# EAGLE design ptvo_fs (EAGLE 9.6.2)
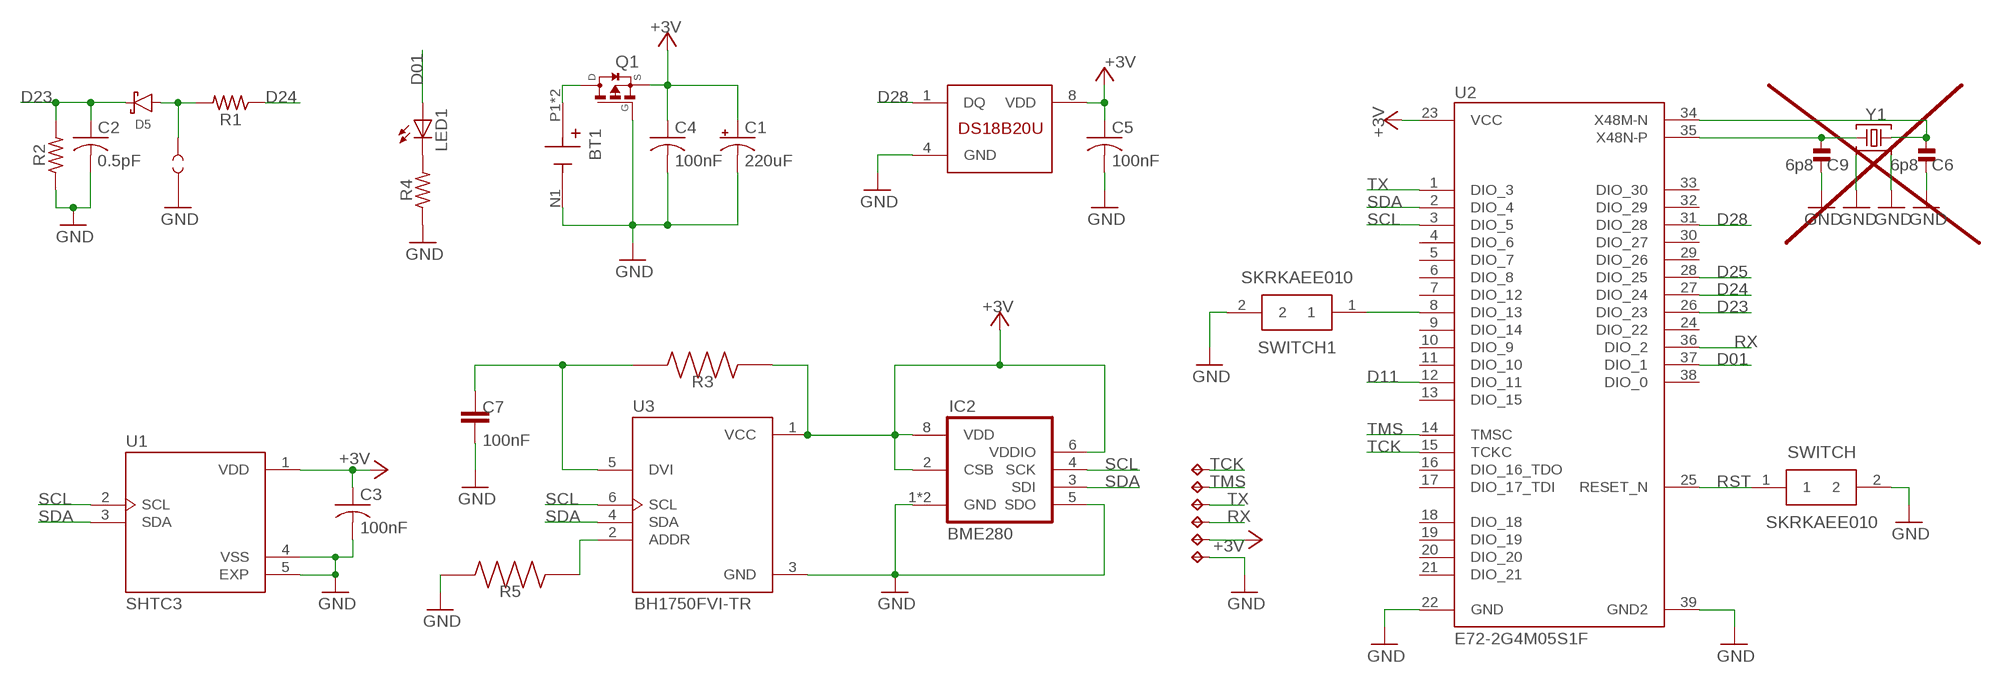
[diagram p0: schematic, sheet 1]

## Parts
BT1  BAT-HLD-001  [BAT_BAT-HLD-001]
C1  220uF  100UF-POLAR-EIA7343-10V-10%(TANT)  [EIA7343]
C2  0.5pF  C-USC0805  [C0805]
C3  100nF  C-USC0805  [C0805]
C4  100nF  C-USC0805  [C0805]
C5  100nF  C-USC0805  [C0805]
C6  6p8  CAP-0402  [_PKG_C_0402]
C7  100nF  CAP0402  [CAPC1005X40N]
C9  6p8  CAP-0402  [_PKG_C_0402]
D5  1N4148WS  DIODE-SCHOTTKY  [SOD-323]
IC1  DS18S20USOP8  [UMAX8]
IC2  BME280  [BME280]
LED1  LEDCHIP-LED0805  [CHIP-LED0805]
Q1  SI2323DS  [SOT23]
R1  10k  R-US_M0805  [M0805]
R2  1M  R-US_M0805  [M0805]
R3  4.7k  RC0402FR-073M6L  [RESC1005X40N]
R4  2.2k  R-US_M0805  [M0805]
R5  4.7k  RC0402FR-073M6L  [RESC1005X40N]
SWITCH  SKRKAEE010  [SKRK]
SWITCH1  SKRKAEE010  [SKRK]
TP1  TEST-POINT2  [PAD.02X.02]
TP2  TEST-POINT2  [PAD.02X.02]
TP3  TPB1,27  [B1,27]
TP4  TPB1,27  [B1,27]
TP5  TPB1,27  [B1,27]
TP6  TPB1,27  [B1,27]
TP7  TPB1,27  [B1,27]
TP8  TPB1,27  [B1,27]
U1  SHTC3  [SON100P200X200X80-5N]
U2  E72-2G4M05S1F  [E72-2G4M05S1F]
U3  BH1750FVI-TR  [XDCR_BH1750FVI-TR]
Y1  Q22FA12800150  48.000MHZ_CX2016DB48000C0FPLC1  [XTAL-4P-2016]

## Nets
+3V3: C1.A(+) C3.1 C4.1 C5.1 IC1.8(VDD) IC2.2(CSB) IC2.6(VDDIO) IC2.8(VDD) Q1.2(S) R3.1 TP6.TP U1.1(VDD) U2.23(VCC) U3.1(VCC) ; supply symbol labelled +3V
D01: LED1.A U2.37(DIO_1)
D11: U2.12(DIO_11)
D23: C2.1 D5.C R2.2 U2.26(DIO_23)
D24: R1.1 U2.27(DIO_24)
D25: U2.28(DIO_25)
D28: IC1.1(DQ) U2.31(DIO_28)
GND: BT1.N1(-) C1.C(-) C2.2 C3.2 C4.2 C5.2 C6.1 C7.2 C9.1 IC1.4(GND) IC2.1(GND) IC2.5(SDO) IC2.7(GND) Q1.1(G) R2.1 R4.1 R5.2 SWITCH1.2 SWITCH.2 TP2.P$1 TP7.TP U1.4(VSS) U1.5(EXP) U2.22(GND) U2.39(GND2) U3.3(GND) Y1.2 Y1.4
N$1: D5.A R1.2 TP1.P$1
N$2: LED1.C R4.2
N$3: SWITCH1.1 U2.8(DIO_13)
N$4: BT1.P1(+) BT1.P2(+) Q1.3(D)
N$5: C6.2 U2.34(X48M-N) Y1.3
N$6: C7.1 R3.2 U3.5(DVI)
N$9: R5.1 U3.2(ADDR)
N$21: C9.2 U2.35(X48N-P) Y1.1
RST: SWITCH.1 U2.25(RESET_N)
RX: TP5.TP U2.36(DIO_2)
SCL: IC2.4(SCK) U1.2(SCL) U2.3(DIO_5) U3.6(SCL)
SDA: IC2.3(SDI) U1.3(SDA) U2.2(DIO_4) U3.4(SDA)
TCK: TP8.TP U2.15(TCKC)
TMS: TP3.TP U2.14(TMSC)
TX: TP4.TP U2.1(DIO_3)
Unconnected: U2.4(DIO_6) U2.5(DIO_7) U2.6(DIO_8) U2.7(DIO_12) U2.9(DIO_14) U2.10(DIO_9) U2.11(DIO_10) U2.13(DIO_15) U2.16(DIO_16_TDO) U2.17(DIO_17_TDI) U2.18(DIO_18) U2.19(DIO_19) U2.20(DIO_20) U2.21(DIO_21) U2.24(DIO_22) U2.29(DIO_26) U2.30(DIO_27) U2.32(DIO_29) U2.33(DIO_30) U2.38(DIO_0)

## Library data of the parts
BT1 = BAT-HLD-2450:BAT-HLD-001
C1 = SparkFun-Capacitors:100UF-POLAR: 100µF polarized capacitors A capacitor is a passive two-terminal electrical component used to store electrical energy temporarily in an electric field.; PROD_ID: CAP-07890; VALUE: 100uF
C2-C5 = adafruit2:C-US: CAPACITOR, American symbol
C6 C9 = ok-discretes-dev:CAP
C7 = discretes-dev:CAP0402: CAP, 0402; AVAILABILITY: Good; DESCRIPTION: RESISTOR, 0402 0.063W 1% 3M6; Resistance:3.6Mohm; Resistance Tolerance:± 1%; Power Rating:0.063W; Voltage Rating:50V; Series:RC32H; Temperature Coefficient:± 100ppm/°C; Resistor Element Type:Thick Film; Resistor Case Style:0402; No. of Pins:2; SVHC:No SVHC; Case Style:0402; External Length / Height:1mm; Temperature Coeff. +:100ppm/°C; Temperature Coeff. -:100ppm/°C; External Depth:0.35mm; External Width:0.5mm; Operating Temperature Range:-55°C to +155°C; Overload Voltage:100V; MF: Yageo; MP: RC0402FR-073M6L; PACKAGE: 1005 Panasonic Electronic Components; PRICE: None; PURCHASE-URL: https://pricing.snapeda.com/search/part/RC0402FR-073M6L/?ref=eda
D5 = pimoroni-passives:DIODE-SCHOTTKY
IC1 = 1wire:DS18S20: High Precision Digital Thermometer This chip provides a onewire thermosensor with approx. 0.5°C accuracy.A programmable over/undertemperure alarm is available. Notes: Vdd must be applied for accurate measurements at low temperatures, as the parasite power circuit otherwise heats the sensor. If parasite power is used, Vdd has to be connected to GND. The DS1822 is a low-cost thermometer chip, the DS18B20 is similar to the DS18S20, but with 9..12 Bit programmable precision. Author: Jan Kandziora <jjj@gmx.de>
IC2 = bosch-bme280:BME280: DIGITAL HUMIDITY, PRESSURE AND TEMPERATURE SENSOR * Digital interface I²C (up to 3.4 MHz) and SPI (3 and 4 wire, up to 10 MHz)* Supply voltage VDD main supply voltage range: 1.71 V to 3.6 V*VDDIO interface voltage range: 1.2 V to 3.6 V Operating range -40…+85 °C, 0…100 % rel. humidity, 300…1100 hPa The library has been designed by Richard Magdycz <https://www.facebook.com/groups/eaglecadsoftUK>
LED1 = adafruit:LED: LED OSRAM: - CHIPLED LG R971, LG N971, LY N971, LG Q971, LY Q971, LO R971, LY R971 LH N974, LH R974 LS Q976, LO Q976, LY Q976 LO Q996 - Hyper CHIPLED LW Q18S LB Q993, LB Q99A, LB R99A - SideLED LS A670, LO A670, LY A670, LG A670, LP A670 LB A673, LV A673, LT A673, LW A673 LH A674 LY A675 LS A676, LA A676, LO A676, LY A676, LW A676 LS A679, LY A679, LG A679 - Hyper Micro SIDELED® LS Y876, LA Y876, LO Y876, LY Y876 LT Y87S - SmartLED LW L88C, LW L88S LB L89C, LB L89S, LG L890 LS L89K, LO L89K, LY L89K LS L896, LA L896, LO L896, LY L896 - TOPLED LS T670, LO T670, LY T670, LG T670, LP T670 LSG T670, LSP T670, LSY T670, LOP T670, LYG T670 LG T671, LOG T671, LSG T671 LB T673, LV T673, LT T673, LW T673 LH T674 LS T676, LA T676, LO T676, LY T676, LB T676, LH T676, LSB T676, LW T676 LB T67C, LV T67C, LT T67C, LS T67K, LO T67K, LY T67K, LW E67C LS E67B, LA E67B, LO E67B, LY E67B, LB E67C, LV E67C, LT E67C LW T67C LS T679, LY T679, LG T679 LS T770, LO T770, LY T770, LG T770, LP T770 LB T773, LV T773, LT T773, LW T773 LH T774 LS E675, LA E675, LY E675, LS T675 LS T776, LA T776, LO T776, LY T776, LB T776 LHGB T686 LT T68C, LB T68C - Hyper Mini TOPLED® LB M676 - Mini TOPLED Santana® LG M470 LS M47K, LO M47K, LY M47K Source: http://www.osram.convergy.de/
Q1 = SI2323DS:SI2323DS: P-Channel MOSFET; AVAILABILITY: Unavailable; DESCRIPTION: P-Channel 20V 3.7A (Ta) 750mW (Ta) Surface Mount SOT-23-3 (TO-236); MF: Vishay Siliconix; MP: SI2323DS; PACKAGE: SOT-23-3 Vishay Siliconix; PRICE: None
R1 R2 R4 = adafruit4:R-US_: RESISTOR, American symbol
R3 R5 = RC0402FR-073M6L:RC0402FR-073M6L: RESISTOR, 0402 0.063W 1% 3M6; Resistance:3.6Mohm; Resistance Tolerance:± 1%; Power Rating:0.063W; Voltage Rating:50V; Series:RC32H; Temperature Coefficient:± 100ppm/°C; Resistor Element Type:Thick Film; Resistor Case Style:0402; No. of Pins:2; SVHC:No SVHC; Case Style:0402; External Length / Height:1mm; Temperature Coeff. +:100ppm/°C; Temperature Coeff. -:100ppm/°C; External Depth:0.35mm; External Width:0.5mm; Operating Temperature Range:-55°C to +155°C; Overload Voltage:100V Check prices <https://pricing.snapeda.com/parts/RC0402FR-073M6L/Yageo/view-part?ref=eda>; AVAILABILITY: Good; DESCRIPTION: RESISTOR, 0402 0.063W 1% 3M6; Resistance:3.6Mohm; Resistance Tolerance:± 1%; Power Rating:0.063W; Voltage Rating:50V; Series:RC32H; Temperature Coefficient:± 100ppm/°C; Resistor Element Type:Thick Film; Resistor Case Style:0402; No. of Pins:2; SVHC:No SVHC; Case Style:0402; External Length / Height:1mm; Temperature Coeff. +:100ppm/°C; Temperature Coeff. -:100ppm/°C; External Depth:0.35mm; External Width:0.5mm; Operating Temperature Range:-55°C to +155°C; Overload Voltage:100V; MF: Yageo; MP: RC0402FR-073M6L; PACKAGE: 1005 Panasonic Electronic Components; PRICE: None; PURCHASE-URL: https://pricing.snapeda.com/search/part/RC0402FR-073M6L/?ref=eda
SWITCH SWITCH1 = SPST Round Button:SKRKAEE010: Tactile Switches 3.9x2.9x2.0mm 160gf Packaging Temp 60oC <https://componentsearchengine.com/Images/1/SKRKAEE010.jpg> Source: Datasheet <http://www.mouser.com/ds/2/15/SKRK-1110686.pdf> Check availability <https://pricing.snapeda.com/parts/SKRKAEE010/ALPS/view-part?ref=eda>; AVAILABILITY: Not in stock; CHECK_PRICES: https://www.snapeda.com/parts/SKRKAEE010/ALPS/view-part/?ref=eda; DESCRIPTION: Switch Tactile N.O. SPST Round Button Gull Wing 0.05A 12VDC 1.57N SMD T/R; MF: ALPS; MP: SKRKAEE010; PACKAGE: None; PRICE: None; SNAPEDA_LINK: https://www.snapeda.com/parts/SKRKAEE010/ALPS/view-part/?ref=snap
TP1 TP2 = SparkFun-Connectors:TEST-POINT: SparkFun Test Points Bare copper test points for troubleshooting or In-Circuit-Testing. These are used by our Production team for verifying production board runs using pogo-pins on test beds. SparkFun Products: SparkFun LSM9DS1 Breakout <https://www.sparkfun.com/products/13284> SparkFun PSOC <https://www.sparkfun.com/products/13714> SparkFun Load Cell Amplifier <https://www.sparkfun.com/products/13879>
TP3-TP8 = testpad:TP: Test pad
U1 = SHTC3:SHTC3: SENSOR HUMI/TEMP I2C 2% SMD Check availability <https://pricing.snapeda.com/parts/SHTC3/Sensirion%20AG/view-part?ref=eda>; AVAILABILITY: In Stock; DESCRIPTION: SENSOR HUMI/TEMP I2C 2% SMD; MF: Sensirion AG; MP: SHTC3; PACKAGE: DFN-4 Sensirion; PRICE: None; PURCHASE-URL: https://pricing.snapeda.com/search/part/SHTC3/?ref=eda
U2 = E72-2G4M05S1F:E72-2G4M05S1F
U3 = BH1750FVI-TR:BH1750FVI-TR: Light to Digital Ambient Light Sensor Digital O/P 1lux to 65535lux 6-Pin WSOF Embossed T/R Check availability <https://pricing.snapeda.com/parts/BH1750FVI-TR/Rohm/view-part?ref=eda>; AVAILABILITY: In Stock; CHECK_PRICES: https://www.snapeda.com/parts/BH1750FVI-TR/Rohm/view-part/?ref=eda; DESCRIPTION: Optical Sensor Ambient 560nm I2C 6-SMD, Flat Lead Exposed Pad; MF: Rohm; MP: BH1750FVI-TR; PACKAGE: SMD-6 ROHM Semiconductor; PRICE: None; PURCHASE-URL: https://www.snapeda.com/api/url_track_click_mouser/?unipart_id=106507&manufacturer=Rohm&part_name=BH1750FVI-TR&search_term=bh1750fvi-tr; SNAPEDA_LINK: https://www.snapeda.com/parts/BH1750FVI-TR/Rohm/view-part/?ref=snap
Y1 = ok-xtal-osc-dev:48.000MHZ_CX2016DB48000C0FPLC1: 48MHz ±10ppm Crystal 7pF 50 Ohms 4-SMD, No Lead Datasheet <https://media.digikey.com/pdf/Data%20Sheets/Kyocera%20International/CX2016DB48000C0FPLC1_DS.pdf>; DIGIKEY_PART: 1253-2042-1-ND; MFG_NAME: KYOCERA; MFG_PART: CX2016DB48000C0FPLC1

## Board
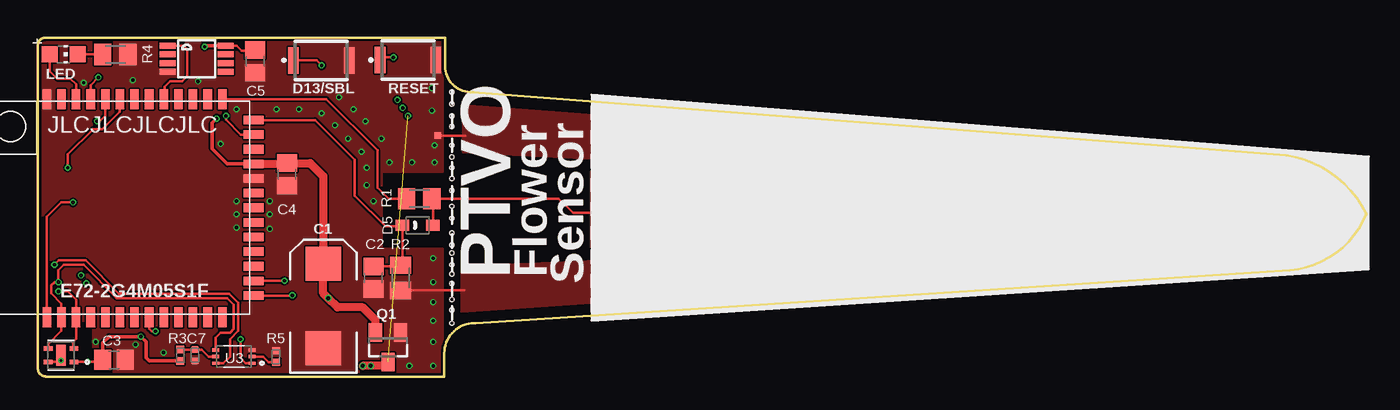
[diagram p1: board, top side]
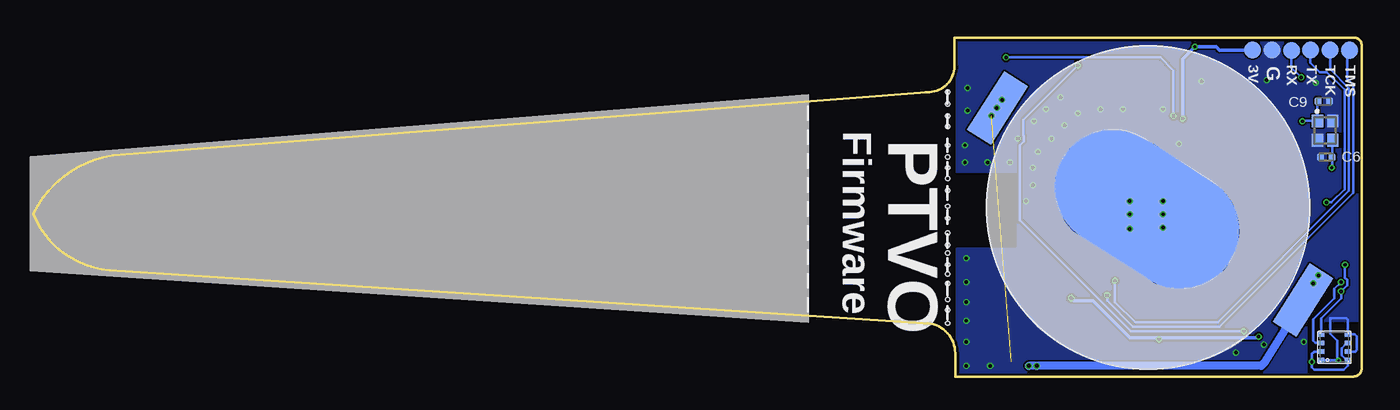
[diagram p2: board, bottom side, seen from below]

Size 99.95 x 25.48 mm. Coordinates in mm from the lower left corner, seen from the top.
Outline: 32.82,21.38 32.7,21.38
Outline: 32.7,21.38 arc-90 30.62,23.35 30.62,25.48 0.53,25.48 arc90 0,24.95 0,0.6 arc90 0.6,0 30.57,0 30.57,1.75 arc-90 32.82,4 32.95,4 94.2,8 arc64 99.95,12.25 arc55 93.95,16.62 32.7,21.38
Copper layers (1*16): Top 0.035559375mm / dielectric 0.17018125mm / Bottom 0.035559375mm
Design rules "oshpark-4layer *": minimum track width 6mil, minimum drill 0.2mm, track to track 5mil, track to pad 5mil, pad to pad 5mil, via to via 5mil, smd to smd 5mil, copper to edge 0.16mm, drill to drill 0.2mm, minimum pad ring 4mil, minimum via ring 4mil, stop-mask expansion 0.05588125mm, vias tented up to drill 50mil, thermal gap 10mil
Holes 0.3 mm at 31.15,4 31.15,5 31.15,5.8 31.15,7 31.15,7.7 31.15,8.4 31.15,9.3 31.15,9.9 31.15,10.8 31.15,11.9 31.15,12.8 31.15,14 31.15,14.9 31.15,15.7 31.15,16.5 31.15,17.4 31.15,18.8 31.15,19.6 31.15,20.5 31.15,21.4

### Footprints (pad centres in the part's own frame; a part is rotated, then mirrored left to right if it is on the bottom)
BAT_BAT-HLD-001 = smd 14.8 x 8.8: N1 -0.127,-0.254 | smd 2.1 x 5.2: P1 -13.704,0.127; P2 13.45,0.254
EIA7343 = smd 2.55 x 2.7: A 3.17,0; C -3.17,0
C0805 = smd 1.3 x 1.5: 1 -0.85,0; 2 0.85,0
_PKG_C_0402 = smd 0.54 x 0.6: 1 -0.43,0; 2 0.43,0
CAPC1005X40N = smd 0.54 x 0.6: 1 -0.432,0; 2 0.432,0
SOD-323 = smd 1 x 0.8: A 1.15,0; C -1.15,0
UMAX8 = smd 0.45 x 1.2: 1 -0.975,-2.175; 2 -0.325,-2.175; 3 0.325,-2.175; 4 0.975,-2.175; 5 0.975,2.175; 6 0.325,2.175; 7 -0.325,2.175; 8 -0.975,2.175
BME280 = smd 0.35 x 0.5: 1 0.975,-1.025; 2 0.325,-1.025; 3 -0.325,-1.025; 4 -0.975,-1.025; 5 -0.975,1.025; 6 -0.325,1.025; 7 0.325,1.025; 8 0.975,1.025
CHIP-LED0805 = smd 1.2 x 1.2: A 0,-1.05; C 0,1.05
SOT23 = smd 1 x 1.4: 1 -0.95,-1.1; 2 0.95,-1.1; 3 0,1.1
M0805 = smd 1.3 x 1.6: 1 -0.95,0; 2 0.95,0
RESC1005X40N = smd 0.54 x 0.6: 1 -0.432,0; 2 0.432,0
SKRK = smd 0.8 x 2: 1 -2.1,0; 2 2.1,0
PAD.02X.02 = smd 0.508 x 0.508: P$1 0,0
B1,27 = smd 1.27 x 1.27: TP 0,0
SON100P200X200X80-5N = smd 0.75 x 0.35: 1 -0.97,0.5; 2 -0.97,-0.5; 3 0.97,-0.5; 4 0.97,0.5 | smd 0.7 x 1.6: 5 0,0
E72-2G4M05S1F = smd 1.5 x 0.65: 1 -8.43,3.15; 2 -8.43,2.05; 3 -8.43,0.95; 4 -8.43,-0.15; 5 -8.43,-1.25; 6 -8.43,-2.35; 7 -8.43,-3.45; 8 -8.43,-4.55; 9 -8.43,-5.65; 10 -8.43,-6.75; 11 -8.43,-7.85; 12 -8.43,-8.95; 13 -8.43,-10.05; 27 7.96,-10.05; 28 7.96,-8.95; 29 7.96,-7.85; 30 7.96,-6.75; 31 7.96,-5.65; 32 7.96,-4.55; 33 7.96,-3.45; 34 7.96,-2.35; 35 7.96,-1.25; 36 7.96,-0.15; 37 7.96,0.95; 38 7.96,2.05; 39 7.96,3.15 | smd 0.65 x 1.5: 14 -6.81,-12.4; 15 -5.71,-12.4; 16 -4.61,-12.4; 17 -3.51,-12.4; 18 -2.41,-12.4; 19 -1.31,-12.4; 20 -0.21,-12.4; 21 0.89,-12.4; 22 1.99,-12.4; 23 3.09,-12.4; 24 4.19,-12.4; 25 5.29,-12.4; 26 6.39,-12.4
XDCR_BH1750FVI-TR = smd 0.55 x 0.25: 1 -1.375,0.5; 2 -1.375,0; 3 -1.375,-0.5; 4 1.375,-0.5; 5 1.375,0; 6 1.375,0.5
XTAL-4P-2016 = smd 0.95 x 0.85: 1 -0.725,-0.575; 2 0.725,-0.575; 3 0.725,0.575; 4 -0.725,0.575

### Placement (x,y rotation side)
BT1  15.9,12.75 327.6 bottom
C1  21.48,5.3 90 top
C2  25.25,7.42 270 top
C3  5.73,1.25 0 top
C4  18.75,15.2 270 top
C5  16.35,23.7 270 top
C6  2.65,16.5 0 bottom
C7  11.82,1.6 270 top
C9  2.85,20.7 180 bottom
D5  28.57,11.38 0 top
IC1  11.95,23.9 270 top
IC2  2.05,2.2 270 bottom
LED1  1.95,24.23 270 top
Q1  26.35,2.2 180 top
R1  28.7,13.38 0 top
R2  27.3,7.42 90 top
R3  10.72,1.6 90 top
R4  5.83,24.23 180 top
R5  17.92,1.5 90 top
SWITCH  27.85,23.8 0 top
SWITCH1  21.32,23.78 0 top
TP1  29.82,13.38 0 top
TP2  30.1,18.12 0 top
TP3  0.92,24.54 90 bottom
TP4  3.85,24.55 90 bottom
TP5  5.29,24.53 90 bottom
TP6  8.21,24.55 90 bottom
TP7  6.75,24.55 90 bottom
TP8  2.36,24.55 90 bottom
U1  1.75,1.6 180 top
U2  3.82,12.9 90 top
U3  14.75,1.5 180 top
Y1  2.75,18.5 270 bottom

### Tracks (layer width: path | path; a pad name or v marks a point on that pad's centre or on a via)
+3V3  (via drill 0.25, 0.3)
  Top 0.2: U3.1 15.65,1 15.25,1.4 v15.25,2.8
  Top 0.203: U1.1 v3.75,1.1 4.73,1.1 C3.1 | IC1.8 14.97,24.88 15.35,24.5 16.3,24.5 C5.1
  Top 0.254: U2.23 14.26,15.99 13.13,17.12 13.13,19.08 v13.45,19.4 | v12.55,24.8 12.62,24.88 IC1.8 | C3.1 4.88,2.52 5.35,3 v7.75,3 8.15,2.6 8.15,1.4 8.38,1.17 R3.1
  Top 0.61: U2.23 18.69,15.99 C4.1 20.5,16.05 21.48,15.07 C1.A 21.48,6.27 v21.85,5.9 22.55,5.2 24.45,5.2 25.4,4.25 Q1.2
  Bottom 0.2: IC2.6 1.12,2.52 1.5,2.14 1.5,1.61 1.12,1.23 IC2.8 1.02,0.83 1.35,0.5 3.55,0.5 3.75,0.7 v3.75,1.1 3.75,1.7 3.57,1.88 IC2.2
  Bottom 0.254: v13.45,19.4 13.45,23.9 v12.55,24.8 10.95,24.8 10.7,24.55 TP6.TP | v7.75,3 7.85,2.9 15.15,2.9 v15.25,2.8 15.35,2.9 17.43,2.9 20.23,5.7 21.65,5.7 v21.85,5.9
D01
  Top 0.203: LED1.A 0.9,22.95 1.45,22.4 2.45,22.4 2.88,21.98 U2.37
D23
  Top 0.203: D5.C 27.42,11.3 | 27.42,11.3 27.42,8.5 R2.2 27.2,8.28 C2.1 | U2.26 20.86,19.29 23.85,16.3 23.85,13.6 26.15,11.3 27.42,11.3
D24
  Top 0.203: R1.1 26.38,13.38 25.55,14.2 25.55,17 21.69,20.86 U2.27
D28
  Top 0.203: IC1.1 10.97,24.88 11.25,24.6 11.25,22.6 10.85,22.2 9.95,22.2 9.55,21.8 9.55,20.94 U2.31
GND  (via drill 0.2, 0.25)
  Top 0.2: U1.5 1.75,1.1
  Top 0.203: R2.1 32.05,6.47 | TP2.P$1 32.12,18.12 32.15,18.1 | U1.4 1.55,1.1 1.65,1 1.75,1.1 v1.75,1.2
  Bottom 0.2: IC2.7 0.48,1.88 0.36,2 0.36,3.01 0.53,3.18 IC2.5 1.02,4.27 1.15,4.4 2.35,4.4 2.35,3.2 1.85,2.7 1.85,1.3 v1.75,1.2 1.77,1.23 IC2.1
  Bottom 0.203: BT1.N1 14.95,11.41 v14.95,11.2 | BT1.N1 15.55,12.6 v14.95,13.2 | BT1.N1 17.05,12.6 v17.45,12.2 | BT1.N1 17.45,11.29 v17.45,11.1 | BT1.N1 15.74,12.2 v14.95,12.2
  other vias: 24.75,14.4 24.75,15.7 24.35,16.9 23.35,17.9 22.35,18.9 21.35,19.8 19.65,20.1 17.95,20.1 25.25,13.2 14.95,20.1 12.05,22.2 29.65,20 29.65,21.7 29.75,8.9 29.75,7.1 22.65,21 23.75,20.1 24.65,19.2 25.85,17.9 26.45,16.1 28.15,16.1 29.85,16.1 13.75,17.5 17.45,13.2 29.75,5.6 29.75,4.2 29.75,2.6 29.75,0.8 27.95,0.8 29.85,17.4 4.35,2.6 7.15,22.3 3.45,22.1 7.35,2.4 9.45,1.8
  pour Top: 31.95,16.88 94.58,13.75 arc-169 94.7,11 31.82,8.25 31.82,4.89 94.37,9.21 arc160 95.06,15.58 31.95,20.41
  pour Top (no thermals): 29.75,18.4 29.75,17.8 30.35,17.8 30.35,18.4
  pour Bottom (no thermals): -0.25,4.2 4.15,4.2 4.15,-0.4 30.45,-0.4 30.45,9.6 25.85,9.6 25.85,15.4 30.45,15.4 30.45,26 -0.25,26
  pour Top (no thermals): -0.15,4.2 4.15,4.2 4.15,-0.8 30.45,-0.8 30.45,9.6 25.85,9.6 25.85,15.4 30.45,15.4 30.45,25.6 -0.15,25.6
N$1
  Top 0.2: 29.9,11.55 D5.A 29.72,13.3 | R1.2 39.17,13.38 40.25,12.3 42.05,12.3
  Top 0.254: 29.72,13.3 R1.2 TP1.P$1
  pour Top: 41.6,15.45 41.6,9.72 94.34,11.64 arc168 94.45,13.08
N$2
  Top 0.203: LED1.C R4.2
N$3  (via drill 0.25)
  Top 0.2: U2.8 8.38,3.58 8.55,3.4 v8.85,3.4 | SWITCH1.1 20.97,23.78 v21.35,23.4
  Bottom 0.2: v8.85,3.4 17.35,3.4 25.7,11.75 25.7,17.41 25.4,17.71 25.4,18.09 25.45,18.14 25.45,19.3 v21.35,23.4
N$4  (via drill 0.25, 0.3)  (1 unrouted)
  Top 0.61: Q1.3 26.05,0.8 v24.45,0.8
  Bottom 0.203: BT1.P1 v27.45,20.2 | BT1.P1 27.85,19.75 v27.85,19.6 | BT1.P1 27.05,20.55 v27.05,20.8
  Bottom 0.254: v3.65,7 3.65,6.51 BT1.P2 3.25,6.91 v3.25,7.6
  Bottom 0.61: BT1.P2 7.35,1 7.55,0.8 v24.45,0.8 v25.05,0.8
N$5  (via drill 0.25)
  Top 0.2: U2.34 6.18,19.93 4.85,18.6 4.15,18.6 2.25,16.7 v2.25,15.7
  Bottom 0.2: Y1.3 2.22,17.73 C6.2 2.22,15.73 v2.25,15.7
N$6
  Top 0.2: R3.2 C7.1 12.32,2.03 12.85,1.5 U3.5
N$9
  Top 0.2: R5.1 17.38,1.07 16.95,1.5 U3.2
N$21  (via drill 0.25)
  Top 0.2: U2.35 5.08,19.62 4.65,19.2 v4.45,19.2
  Bottom 0.2: C9.2 3.32,20.66 Y1.1 4.43,19.23 v4.45,19.2
RST  (via drill 0.25)
  Top 0.203: U2.25 15.26,18.19 14.15,19.3 v14.15,19.6 | v26.75,24 25.95,24 SWITCH.1
  Bottom 0.203: v14.15,19.6 14.15,23 15.15,24 v26.75,24
RX  (via drill 0.25)
  Top 0.203: U2.36 3.98,21.93 v4.55,22.5
  Bottom 0.203: TP5.TP 5.29,23.24 v4.55,22.5
SCL  (via drill 0.25)
  Top 0.2: U1.2 2.65,2.17 2.65,2.6 2.88,2.83 U2.3 2.88,5.77 2.25,6.4 v1.55,6.4 | U3.6 13.95,1 14.45,1.5 14.45,2.8 15.08,3.43 15.08,5.53 14.38,6.23 6.08,6.23 3.58,8.73 1.58,8.73 v1.25,8.4
  Bottom 0.2: IC2.4 3.05,3.2 3.05,4.4 1.55,5.9 v1.55,6.4 1.1,6.85 1.1,7.29 1.25,7.44 v1.25,8.4
SDA  (via drill 0.25)
  Top 0.2: U1.3 0.78,2.43 1.77,3.43 U2.2 1.77,5.47 1,6.25 1,6.85 1.25,7.1 v1.55,7.1 1.55,8 1.95,8.4 3.45,8.4 5.95,5.9 14.25,5.9 14.75,5.4 14.75,3.6 14.45,3.3 13.75,3.3 13.38,2.93 U3.4
  Bottom 0.2: IC2.3 3.48,2.52 3.65,2.7 3.65,4.3 2.05,5.9 2.05,6.6 v1.55,7.1
TCK  (via drill 0.25)
  Top 0.203: U2.15 v18.54,7.19 v18.55,7.2
  Bottom 0.203: TP8.TP 2.36,23.12 0.95,21.7 0.95,13.97 10.83,4.09 17.04,4.09 18.55,5.6 v18.55,7.2
TMS  (via drill 0.25)
  Top 0.203: U2.14 v19.14,6.09 v19.15,6.1
  Bottom 0.203: v19.15,6.1 19.15,5.7 17.21,3.76 10.69,3.76 0.62,13.83 0.62,21.94 1.07,22.38 1.07,24.39 TP3.TP 0.62,24.24
TX  (via drill 0.25)
  Top 0.203: U2.1 0.67,12.03 1.75,13.1 v2.65,13.1
  Bottom 0.203: v2.65,13.1 2.28,13.1 1.28,14.1 1.28,21.56 2.62,22.9 3.15,22.9 3.85,23.61 TP4.TP

### Text on the board
tNames: LED | D13/SBL | RESET | JLCJLCJLCJLC | PTVO | Flower | Sensor | E72-2G4M05S1F
bNames: TMS | TCK | TX | RX | G | 3V | Firmware | PTVO